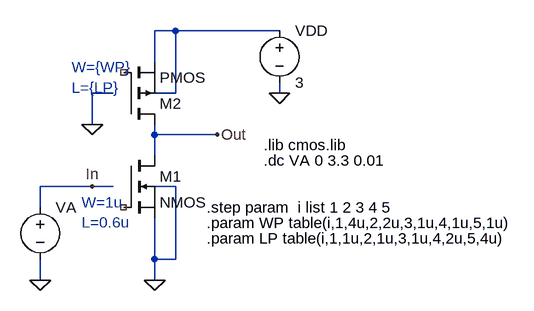
[diagram p0: schematic pseudo-nmos-invdc.asc]
pseudo-nmos-invdc.asc, the LTspice schematic file:
Version 4
SHEET 1 1292 680
WIRE -592 -96 -624 -96
WIRE -432 -96 -592 -96
WIRE -624 -48 -624 -96
WIRE -688 0 -720 0
WIRE -592 0 -592 -96
WIRE -592 0 -624 0
WIRE -432 0 -432 -16
WIRE -720 48 -720 0
WIRE -624 64 -624 48
WIRE -528 64 -624 64
WIRE -624 96 -624 64
WIRE -720 144 -800 144
WIRE -688 144 -720 144
WIRE -592 144 -624 144
WIRE -800 176 -800 144
WIRE -624 256 -624 192
WIRE -592 256 -592 144
WIRE -592 256 -624 256
WIRE -800 288 -800 256
WIRE -624 288 -624 256
FLAG -624 288 0
FLAG -432 0 0
FLAG -720 144 In
FLAG -528 64 Out
FLAG -800 288 0
FLAG -720 48 0
SYMBOL voltage -432 -112 R0
WINDOW 123 0 0 Left 2
WINDOW 39 0 0 Left 2
SYMATTR InstName VDD
SYMATTR Value 3
SYMBOL voltage -800 160 R0
WINDOW 123 0 0 Left 2
WINDOW 39 0 0 Left 2
SYMATTR InstName VA
SYMATTR Value ""
SYMBOL pmos -672 48 M180
WINDOW 39 56 100 Left 2
WINDOW 40 56 128 Left 2
SYMATTR InstName M2
SYMATTR Value2 l={LP} w={WP}
SYMATTR SpiceModel ""
SYMATTR Value PMOS
SYMBOL nmos -672 96 R0
SYMATTR InstName M1
SYMATTR Value2 l=0.6u w=1u
SYMATTR Value NMOS
TEXT -456 80 Left 2 !.lib cmos.lib
TEXT -456 104 Left 2 !.dc VA 0 3.3 0.01
TEXT -544 176 Left 2 !.step param  i list 1 2 3 4 5
TEXT -752 -40 Left 2 ;W={WP}\nL={LP}
TEXT -736 168 Left 2 ;W=1u\nL=0.6u
TEXT -544 200 Left 2 !.param WP table(i,1,4u,2,2u,3,1u,4,1u,5,1u)
TEXT -544 224 Left 2 !.param LP table(i,1,1u,2,1u,3,1u,4,2u,5,4u)

The netlist it stands for:
* pseudo-nmos-invdc.asc
VDD N001 0 3
VA In 0
* M2: PMOS l={LP} w={WP} (symbol pmos not certain, pin order unknown); nets seen at it: N001, Out
* M1: NMOS l=0.6u w=1u (symbol nmos not certain, pin order unknown); nets seen at it: 0, Out
.lib cmos.lib
.dc VA 0 3.3 0.01
.step param  i list 1 2 3 4 5
* W={WP}
* L={LP}
* W=1u
* L=0.6u
.param WP table(i,1,4u,2,2u,3,1u,4,1u,5,1u)
.param LP table(i,1,1u,2,1u,3,1u,4,2u,5,4u)
.backanno
.end